# Altium schematic sheet MainSchematic.SchDoc
size Letter; Organization: Altium Limited; Address1: L3, 12a Rodborough Rd; Address2: Frenchs Forest; Address3: NSW; Address4: Australia 2086
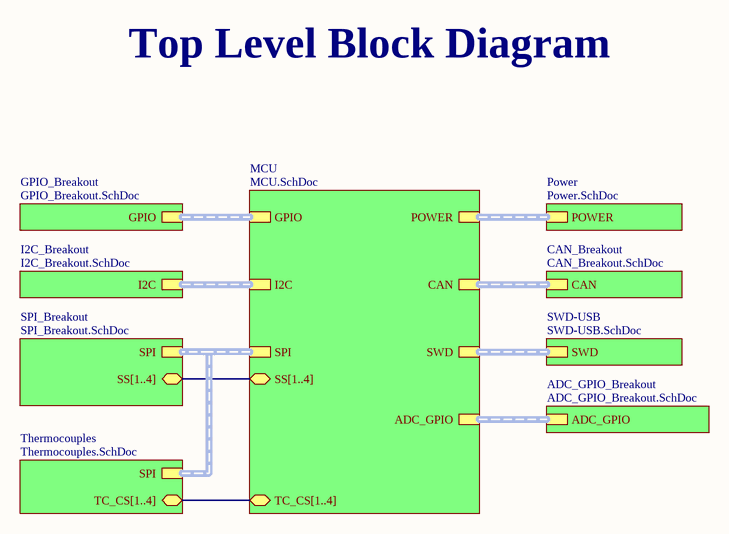
[diagram p0: MainSchematic.SchDoc]

## Sub-sheets
ADC_GPIO_Breakout = ADC_GPIO_Breakout.SchDoc: ADC_GPIO (harness ADC_GPIO)
CAN_Breakout = CAN_Breakout.SchDoc: CAN (harness CAN)
GPIO_Breakout = GPIO_Breakout.SchDoc: GPIO (harness GPIO)
I2C_Breakout = I2C_Breakout.SchDoc: I2C (harness I2C)
MCU = MCU.SchDoc: I2C (harness I2C), GPIO (harness GPIO), SPI (harness SPI), ADC_GPIO (harness ADC_GPIO), CAN (harness CAN), SWD (harness SWD), POWER (harness POWER), TC_CS[1..4] (bidir), SS[1..4] (bidir)
Power = Power.SchDoc: POWER (harness POWER)
SPI_Breakout = SPI_Breakout.SchDoc: SPI (harness SPI), SS[1..4] (bidir)
SWD-USB = SWD-USB.SchDoc: SWD (harness SWD)
Thermocouples = Thermocouples.SchDoc: SPI (harness SPI), TC_CS[1..4] (bidir)

## Buses and harness runs
bus sheet MCU/SS[1..4] = sheet SPI_Breakout/SS[1..4]
bus sheet MCU/TC_CS[1..4] = sheet Thermocouples/TC_CS[1..4]
harness sheet ADC_GPIO_Breakout/ADC_GPIO = sheet MCU/ADC_GPIO
harness sheet CAN_Breakout/CAN = sheet MCU/CAN
harness sheet GPIO_Breakout/GPIO = sheet MCU/GPIO
harness sheet I2C_Breakout/I2C = sheet MCU/I2C
harness sheet MCU/POWER = sheet Power/POWER
harness sheet MCU/SPI = sheet SPI_Breakout/SPI = sheet Thermocouples/SPI
harness sheet MCU/SWD = sheet SWD-USB/SWD

## Notes on the sheet
- Top Level Block Diagram
- Title
- Size:
- Date:
- Letter
- Number:
- Time:
- Revision:
- Sheet
- of
- File: